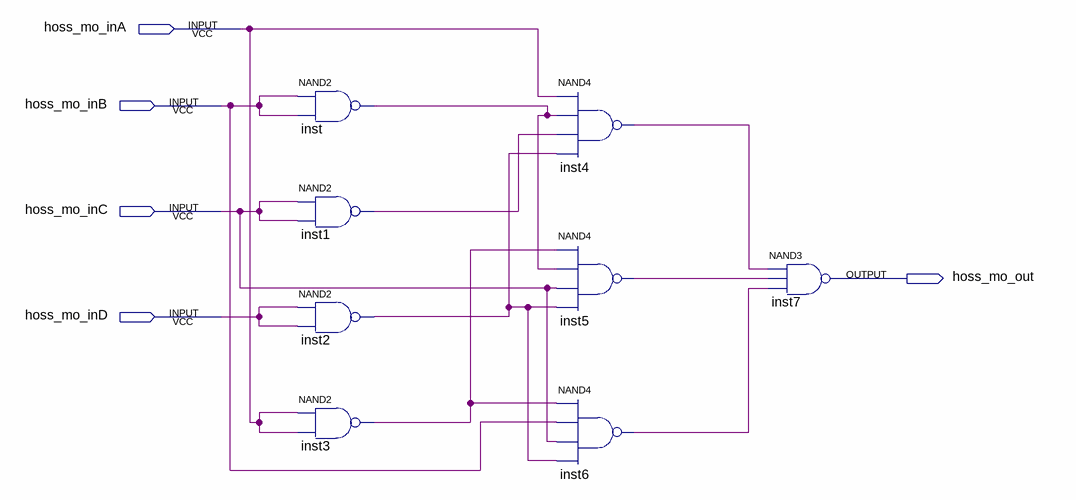
[diagram p0: schematic sheet]
// Quartus schematic segmentA.bdf as structural Verilog: 8 symbols, 5 pins
module segmentA (
  input  hoss_mo_inA,
  input  hoss_mo_inB,
  input  hoss_mo_inC,
  input  hoss_mo_inD,
  output hoss_mo_out
);

  wire inst1_out, inst2_out, inst3_out, inst4_out, inst5_out, inst6_out, inst_out;

  nand inst (inst_out, hoss_mo_inB, hoss_mo_inB);
  nand inst1 (inst1_out, hoss_mo_inC, hoss_mo_inC);
  nand inst2 (inst2_out, hoss_mo_inD, hoss_mo_inD);
  nand inst3 (inst3_out, hoss_mo_inA, hoss_mo_inA);
  nand inst4 (inst4_out, hoss_mo_inA, inst_out, inst1_out, inst2_out);
  nand inst5 (inst5_out, inst3_out, inst_out, hoss_mo_inC, inst2_out);
  nand inst6 (inst6_out, inst3_out, hoss_mo_inB, hoss_mo_inC, inst2_out);
  nand inst7 (hoss_mo_out, inst4_out, inst5_out, inst6_out);
endmodule
